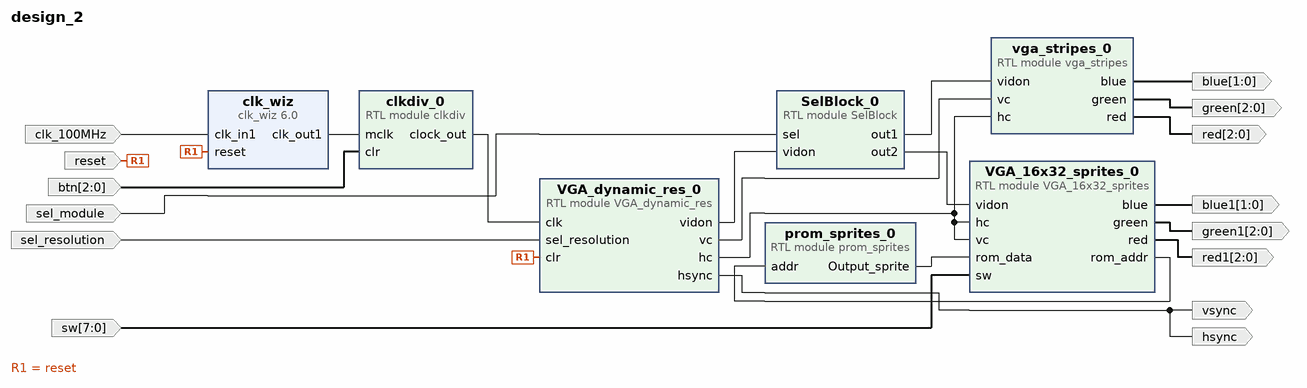
[diagram p0: block diagram of the top level]
# Vivado block design design_2, xczu7ev-ffvc1156-2-e, Vivado 2019.1
create_bd_design design_2

create_bd_port -dir I -type rst reset
set_property -dict {CONFIG.POLARITY ACTIVE_HIGH} [get_bd_ports reset]
create_bd_port -dir I -type clk clk_100MHz
set_property -dict {CONFIG.FREQ_HZ 100000000} [get_bd_ports clk_100MHz]
create_bd_port -dir I -from 2 -to 0 btn
create_bd_port -dir O hsync
create_bd_port -dir O vsync
create_bd_port -dir O -from 1 -to 0 blue
create_bd_port -dir O -from 2 -to 0 green
create_bd_port -dir O -from 2 -to 0 red
create_bd_port -dir I sel_module
create_bd_port -dir I -from 7 -to 0 sw
create_bd_port -dir O -from 1 -to 0 blue1
create_bd_port -dir O -from 2 -to 0 green1
create_bd_port -dir O -from 2 -to 0 red1
create_bd_port -dir I sel_resolution

create_bd_cell -type module -reference vga_stripes vga_stripes_0
create_bd_cell -type ip -vlnv xilinx.com:ip:clk_wiz:6.0 clk_wiz
set_property -dict {CONFIG.RESET_BOARD_INTERFACE reset CONFIG.USE_BOARD_FLOW true} [get_bd_cells clk_wiz]
create_bd_cell -type module -reference prom_sprites prom_sprites_0
create_bd_cell -type module -reference VGA_16x32_sprites VGA_16x32_sprites_0
create_bd_cell -type module -reference SelBlock SelBlock_0
create_bd_cell -type module -reference VGA_dynamic_res VGA_dynamic_res_0
create_bd_cell -type module -reference clkdiv clkdiv_0

# ---- connections ----

connect_bd_net [get_bd_ports clk_100MHz] [get_bd_pins clk_wiz/clk_in1]
connect_bd_net [get_bd_ports btn] [get_bd_pins clkdiv_0/clr]
connect_bd_net [get_bd_pins vga_stripes_0/red] [get_bd_ports red]
connect_bd_net [get_bd_pins vga_stripes_0/green] [get_bd_ports green]
connect_bd_net [get_bd_pins vga_stripes_0/blue] [get_bd_ports blue]
connect_bd_net [get_bd_pins SelBlock_0/out1] [get_bd_pins vga_stripes_0/vidon]
connect_bd_net [get_bd_pins SelBlock_0/out2] [get_bd_pins VGA_16x32_sprites_0/vidon]
connect_bd_net -net sel_1 [get_bd_ports sel_module] [get_bd_pins SelBlock_0/sel]
connect_bd_net [get_bd_pins prom_sprites_0/Output_sprite] [get_bd_pins VGA_16x32_sprites_0/rom_data]
connect_bd_net [get_bd_ports sw] [get_bd_pins VGA_16x32_sprites_0/sw]
connect_bd_net [get_bd_pins VGA_16x32_sprites_0/rom_addr] [get_bd_pins prom_sprites_0/addr]
connect_bd_net [get_bd_pins VGA_16x32_sprites_0/red] [get_bd_ports red1]
connect_bd_net [get_bd_pins VGA_16x32_sprites_0/green] [get_bd_ports green1]
connect_bd_net [get_bd_pins VGA_16x32_sprites_0/blue] [get_bd_ports blue1]
connect_bd_net [get_bd_ports reset] [get_bd_pins clk_wiz/reset] [get_bd_pins VGA_dynamic_res_0/clr]
connect_bd_net [get_bd_pins clk_wiz/clk_out1] [get_bd_pins clkdiv_0/mclk]
connect_bd_net [get_bd_pins clkdiv_0/clock_out] [get_bd_pins VGA_dynamic_res_0/clk]
connect_bd_net [get_bd_ports sel_resolution] [get_bd_pins VGA_dynamic_res_0/sel_resolution]
connect_bd_net [get_bd_pins VGA_dynamic_res_0/hc] \
  [get_bd_pins VGA_16x32_sprites_0/hc] [get_bd_pins vga_stripes_0/hc] [get_bd_pins VGA_16x32_sprites_0/vc]
connect_bd_net [get_bd_pins VGA_dynamic_res_0/vidon] [get_bd_pins SelBlock_0/vidon]
connect_bd_net [get_bd_pins VGA_dynamic_res_0/vc] [get_bd_pins vga_stripes_0/vc]
connect_bd_net [get_bd_pins VGA_dynamic_res_0/hsync] [get_bd_ports hsync] [get_bd_ports vsync]

validate_bd_design
save_bd_design
